# Altium schematic sheet Main.SchDoc: Smartknob Screen
size A3; DrawnBy: Mani Magnusson; Revision: 1; SheetNumber: 1; SheetTotal: 1
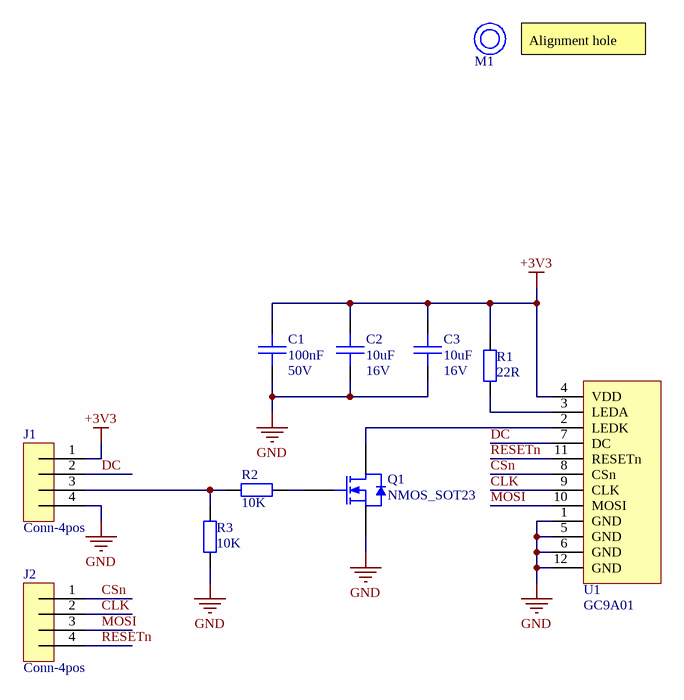
[diagram p0: Main.SchDoc]

## Parts
C1  value 100nF  Voltage: 50V  [C0603]  (hidden comment: CAP)
C2  value 10uF  Voltage: 16V  [C0805]  (hidden comment: CAP)
C3  value 10uF  Voltage: 16V  [C0805]  (hidden comment: CAP)
J1  Conn-4pos  [2mm_pads_4]
J2  Conn-4pos  [2mm_pads_4]
M1  Mounting_Hole_Unplated  [M1.6_Close_Unplated]  (value not drawn)
Q1  NMOS_SOT23  [SOT23]
R1  value 22R  [R0603]  (hidden comment: RES)
R2  value 10K  [R0603]  (hidden comment: RES)
R3  value 10K  [R0603]  (hidden comment: RES)
U1  GC9A01  [GC9A01]

## Nets
+3V3: C1.1 C2.1 C3.1 J1.1 R1.2 U1.4(VDD)
GND: C1.2 C2.2 C3.2 J1.4 Q1.2(S) R3.1 U1.1(GND) U1.5(GND) U1.6(GND) U1.12(GND)
CLK: J2.2 U1.9(CLK)
CSn: J2.1 U1.8(CSn)
DC: J1.2 U1.7(DC)
MOSI: J2.3 U1.10(MOSI)
RESETn: J2.4 U1.11(RESETn)
NetJ1_3: J1.3 R2.1 R3.2
NetQ1_1: Q1.1(G) R2.2
NetQ1_3: Q1.3(D) U1.2(LEDK)
NetR1_1: R1.1 U1.3(LEDA)

## Notes on the sheet
- (near M1) Alignment hole
- Sheet title:
- Revision:
- Drawn by:
- Date:
- File:

## Library data of the parts
C1 = CGA3E2X7R1H104K080AA: General purpose ceramic capacitor; Manufacturer: TDK Corporation; Specification: X7R, 50V, AEC-Q200 Qualified; Ready for use: y; Fitted: Fitted; Package Ref: C0603; Part Reference: CGA3E2X7R1H104K080AA; Manufacturer Part No: CGA3E2X7R1H104K080AA; Supplier: Digi-Key; Supplier Part No: 445-5666-1-ND; Generic: Generic
C2 C3 = CGA4J1X7S1C106K125AC: General purpose ceramic capacitor; Manufacturer: TDK Corporation; Specification: X7S, 16V, AEC-Q200 Qualified; Ready for use: y; Fitted: Fitted; Package Ref: C0805; Part Reference: CGA4J1X7S1C106K125AC; Manufacturer Part No: CGA4J1X7S1C106K125AC; Supplier: Digi-Key; Supplier Part No: 445-16110-1-ND; Generic: Generic
J1 J2 = 2mm_pads_4: 2mm pitch solder pads; Ready for use: y; Fitted: Fitted; Package Ref: 2mm_pads_4; Part Reference: 2mm_pads_4; Manufacturer Part No: 2mm_pads_4; Generic: Generic
M1 = M1.6_Close_Unplated: M1.6 Hole, Unplated; Specification: Close clearance; Ready for use: y; Fitted: Fitted; Package Ref: M1.6_Close_Unplated; Part Reference: M1.6_Close_Unplated; Generic: Generic
Q1 = BSS138: General purpose N-Channel MOSFET in SOT23 packagge; Part Reference: BSS138; Manufacturer: onsemi; Specification: Vds 50V, Id 220mA; Value: NMOS; Ready for use: y; Fitted: Fitted; Package Ref: SOT23; Manufacturer Part No: BSS138; Supplier: Digi-Key; Supplier Part No: BSS138CT-ND; Generic: Generic
R1 = CRCW060322R0JNEA: General purpose automotive thick film resistor; Manufacturer: Vishay Dale; Specification: 5%, 200ppm, 0.1W, AEC-Q200 Qualified; Ready for use: y; Fitted: Fitted; Package Ref: R0603; Part Reference: CRCW060322R0JNEA; Manufacturer Part No: CRCW060322R0JNEA; Supplier: Digi-Key; Supplier Part No: 541-22GCT-ND; Generic: Generic
R2 R3 = CRCW060310K0JNEA: General purpose automotive thick film resistor; Manufacturer: Vishay Dale; Specification: 5%, 200ppm, 0.1W, AEC-Q200 Qualified; Ready for use: y; Fitted: Fitted; Package Ref: R0603; Part Reference: CRCW060310K0JNEA; Manufacturer Part No: CRCW060310K0JNEA; Supplier: Digi-Key; Supplier Part No: 541-10KGCT-ND; Generic: Generic
U1 = GC9A01: 240x240 px round IPS display; Generic: Non Generic; Ready for use: n; Fitted: Fitted; Package Ref: GC9A01; Part Reference: GC9A01; Manufacturer: N/A; Manufacturer Part No: GC9A01; Supplier: N/A; Supplier Part No: N/A; Value: Display